# Altium project bms_afe_tester-1_0.PrjPcb (part 1 of 2)
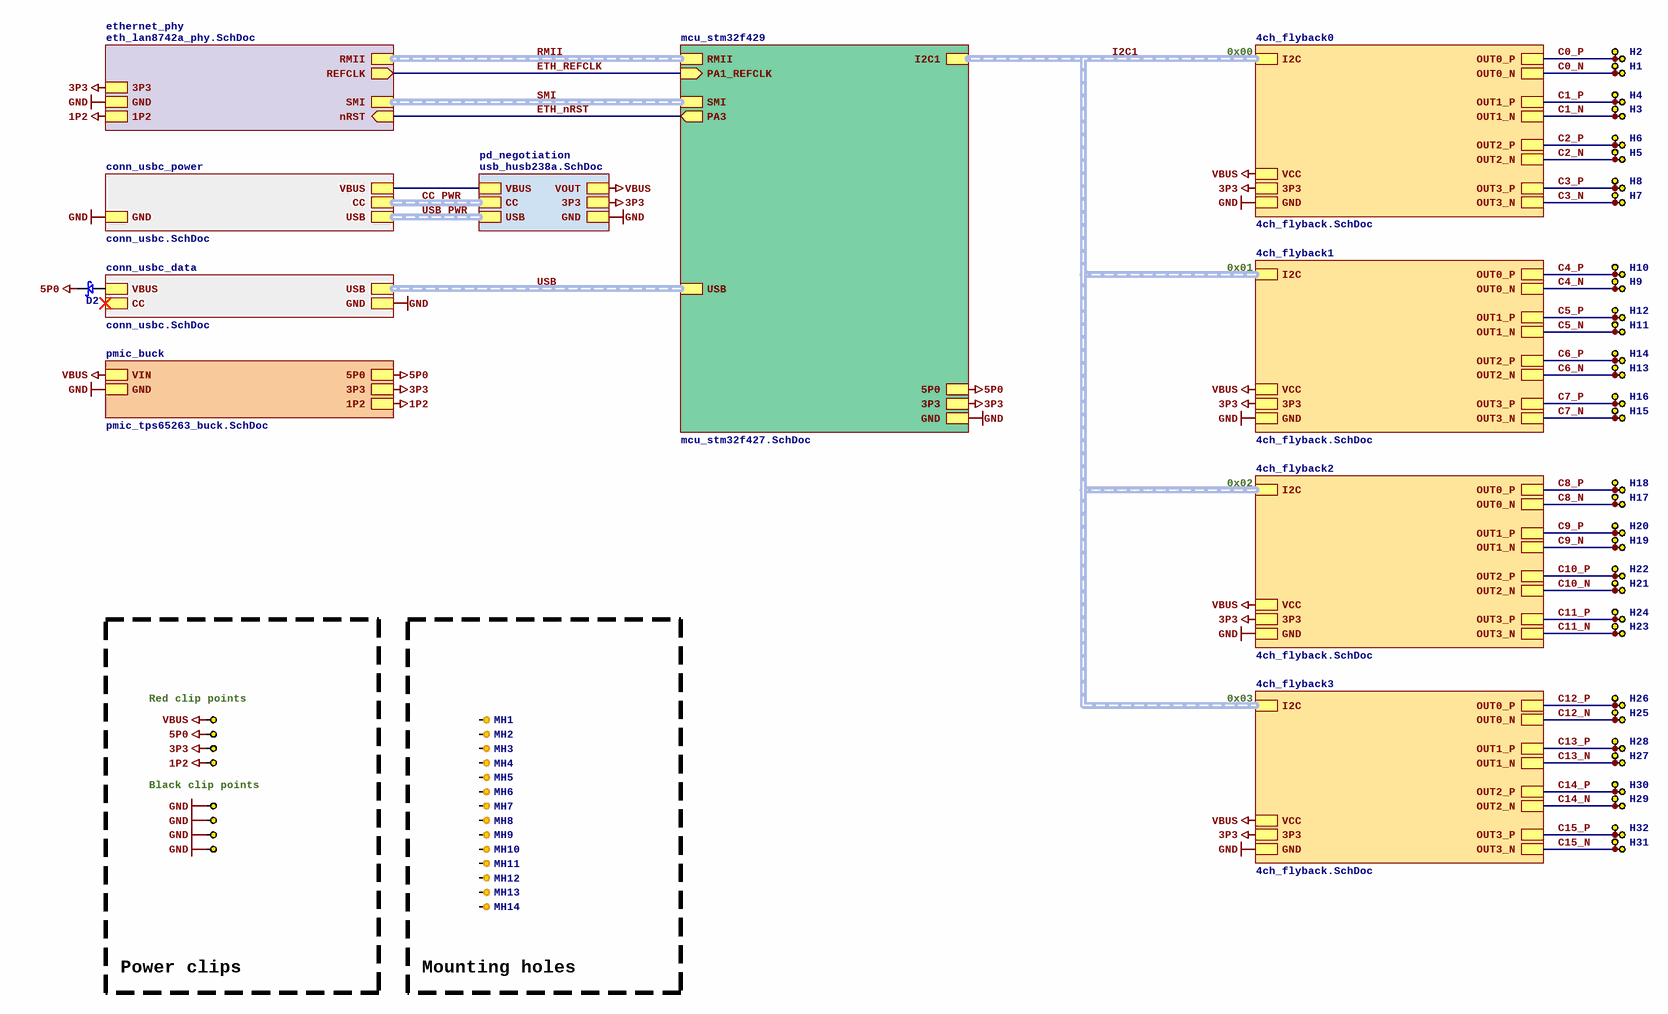
[diagram p0: top.SchDoc]
9 sheets, 576 parts. Net scope: strictly hierarchical (ports join the sheet entries above them; power ports are local).
Board file: bms_afe_tester-1_0.PcbDoc
Sheets:
  top.SchDoc
    mcu_stm32f429 = mcu_stm32f427.SchDoc
    conn_usbc_power = conn_usbc.SchDoc
    pd_negotiation = usb_husb238a.SchDoc
    ethernet_phy = eth_lan8742a_phy.SchDoc
    4ch_flyback0 = 4ch_flyback.SchDoc
      flyback0 = flyback_circuit.SchDoc
      flyback1 = flyback_circuit.SchDoc
      flyback2 = flyback_circuit.SchDoc
      flyback3 = flyback_circuit.SchDoc
      dac0 = dac_dac4320_4ch.SchDoc
    4ch_flyback1 = 4ch_flyback.SchDoc
      flyback0 = flyback_circuit.SchDoc
      flyback1 = flyback_circuit.SchDoc
      flyback2 = flyback_circuit.SchDoc
      flyback3 = flyback_circuit.SchDoc
      dac0 = dac_dac4320_4ch.SchDoc
    4ch_flyback2 = 4ch_flyback.SchDoc
      flyback0 = flyback_circuit.SchDoc
      flyback1 = flyback_circuit.SchDoc
      flyback2 = flyback_circuit.SchDoc
      flyback3 = flyback_circuit.SchDoc
      dac0 = dac_dac4320_4ch.SchDoc
    4ch_flyback3 = 4ch_flyback.SchDoc
      flyback0 = flyback_circuit.SchDoc
      flyback1 = flyback_circuit.SchDoc
      flyback2 = flyback_circuit.SchDoc
      flyback3 = flyback_circuit.SchDoc
      dac0 = dac_dac4320_4ch.SchDoc
    pmic_buck = pmic_tps65263_buck.SchDoc
    conn_usbc_data = conn_usbc.SchDoc

## Sheet top.SchDoc
size B; SheetNumber: 1

### Parts
D2  B340A-13-F  [SMA]  (value not drawn)
H1  SMTSO-M2-10ET  [SMTSO-M2-10ET]  (value not drawn)
H2  SMTSO-M2-10ET  [SMTSO-M2-10ET]  (value not drawn)
H3  SMTSO-M2-10ET  [SMTSO-M2-10ET]  (value not drawn)
H4  SMTSO-M2-10ET  [SMTSO-M2-10ET]  (value not drawn)
H5  SMTSO-M2-10ET  [SMTSO-M2-10ET]  (value not drawn)
H6  SMTSO-M2-10ET  [SMTSO-M2-10ET]  (value not drawn)
H7  SMTSO-M2-10ET  [SMTSO-M2-10ET]  (value not drawn)
H8  SMTSO-M2-10ET  [SMTSO-M2-10ET]  (value not drawn)
H9  SMTSO-M2-10ET  [SMTSO-M2-10ET]  (value not drawn)
H10  SMTSO-M2-10ET  [SMTSO-M2-10ET]  (value not drawn)
H11  SMTSO-M2-10ET  [SMTSO-M2-10ET]  (value not drawn)
H12  SMTSO-M2-10ET  [SMTSO-M2-10ET]  (value not drawn)
H13  SMTSO-M2-10ET  [SMTSO-M2-10ET]  (value not drawn)
H14  SMTSO-M2-10ET  [SMTSO-M2-10ET]  (value not drawn)
H15  SMTSO-M2-10ET  [SMTSO-M2-10ET]  (value not drawn)
H16  SMTSO-M2-10ET  [SMTSO-M2-10ET]  (value not drawn)
H17  SMTSO-M2-10ET  [SMTSO-M2-10ET]  (value not drawn)
H18  SMTSO-M2-10ET  [SMTSO-M2-10ET]  (value not drawn)
H19  SMTSO-M2-10ET  [SMTSO-M2-10ET]  (value not drawn)
H20  SMTSO-M2-10ET  [SMTSO-M2-10ET]  (value not drawn)
H21  SMTSO-M2-10ET  [SMTSO-M2-10ET]  (value not drawn)
H22  SMTSO-M2-10ET  [SMTSO-M2-10ET]  (value not drawn)
H23  SMTSO-M2-10ET  [SMTSO-M2-10ET]  (value not drawn)
H24  SMTSO-M2-10ET  [SMTSO-M2-10ET]  (value not drawn)
H25  SMTSO-M2-10ET  [SMTSO-M2-10ET]  (value not drawn)
H26  SMTSO-M2-10ET  [SMTSO-M2-10ET]  (value not drawn)
H27  SMTSO-M2-10ET  [SMTSO-M2-10ET]  (value not drawn)
H28  SMTSO-M2-10ET  [SMTSO-M2-10ET]  (value not drawn)
H29  SMTSO-M2-10ET  [SMTSO-M2-10ET]  (value not drawn)
H30  SMTSO-M2-10ET  [SMTSO-M2-10ET]  (value not drawn)
H31  SMTSO-M2-10ET  [SMTSO-M2-10ET]  (value not drawn)
H32  SMTSO-M2-10ET  [SMTSO-M2-10ET]  (value not drawn)
MH1  HOLE  [HOLE_M3]  (value not drawn)  (no BOM)
MH2  HOLE  [HOLE_M3]  (value not drawn)  (no BOM)
MH3  HOLE  [HOLE_M3]  (value not drawn)  (no BOM)
MH4  HOLE  [HOLE_M3]  (value not drawn)  (no BOM)
MH5  HOLE  [HOLE_M3]  (value not drawn)  (no BOM)
MH6  HOLE  [HOLE_M3]  (value not drawn)  (no BOM)
MH7  HOLE  [HOLE_M3]  (value not drawn)  (no BOM)
MH8  HOLE  [HOLE_M3]  (value not drawn)  (no BOM)
MH9  HOLE  [HOLE_M3]  (value not drawn)  (no BOM)
MH10  HOLE  [HOLE_M3]  (value not drawn)  (no BOM)
MH11  HOLE  [HOLE_M3]  (value not drawn)  (no BOM)
MH12  HOLE  [HOLE_M3]  (value not drawn)  (no BOM)
MH13  HOLE  [HOLE_M3]  (value not drawn)  (no BOM)
MH14  HOLE  [HOLE_M3]  (value not drawn)  (no BOM)
TP3  RH-5000  [TP_RH-5000]  (value not drawn)
TP4  RH-5000  [TP_RH-5000]  (value not drawn)
TP5  RH-5001  [TP_RH-5001]  (value not drawn)
TP6  RH-5000  [TP_RH-5000]  (value not drawn)
TP7  RH-5001  [TP_RH-5001]  (value not drawn)
TP8  RH-5000  [TP_RH-5000]  (value not drawn)
TP9  RH-5001  [TP_RH-5001]  (value not drawn)
TP10  RH-5000  [TP_RH-5000]  (value not drawn)
TP11  RH-5001  [TP_RH-5001]  (value not drawn)
TP12  RH-5000  [TP_RH-5000]  (value not drawn)
TP13  RH-5001  [TP_RH-5001]  (value not drawn)
TP14  RH-5000  [TP_RH-5000]  (value not drawn)
TP15  RH-5001  [TP_RH-5001]  (value not drawn)
TP16  RH-5000  [TP_RH-5000]  (value not drawn)
TP17  RH-5001  [TP_RH-5001]  (value not drawn)
TP18  RH-5000  [TP_RH-5000]  (value not drawn)
TP19  RH-5001  [TP_RH-5001]  (value not drawn)
TP20  RH-5000  [TP_RH-5000]  (value not drawn)
TP21  RH-5001  [TP_RH-5001]  (value not drawn)
TP22  RH-5000  [TP_RH-5000]  (value not drawn)
TP23  RH-5001  [TP_RH-5001]  (value not drawn)
TP24  RH-5000  [TP_RH-5000]  (value not drawn)
TP25  RH-5001  [TP_RH-5001]  (value not drawn)
TP26  RH-5000  [TP_RH-5000]  (value not drawn)
TP27  RH-5001  [TP_RH-5001]  (value not drawn)
TP28  RH-5000  [TP_RH-5000]  (value not drawn)
TP29  RH-5001  [TP_RH-5001]  (value not drawn)
TP30  RH-5000  [TP_RH-5000]  (value not drawn)
TP31  RH-5001  [TP_RH-5001]  (value not drawn)
TP32  RH-5000  [TP_RH-5000]  (value not drawn)
TP33  RH-5000  [TP_RH-5000]  (value not drawn)
TP34  RH-5001  [TP_RH-5001]  (value not drawn)
TP35  RH-5000  [TP_RH-5000]  (value not drawn)
TP36  RH-5000  [TP_RH-5000]  (value not drawn)
TP37  RH-5000  [TP_RH-5000]  (value not drawn)
TP38  RH-5001  [TP_RH-5001]  (value not drawn)
TP39  RH-5001  [TP_RH-5001]  (value not drawn)
TP41  RH-5001  [TP_RH-5001]  (value not drawn)
TP43  RH-5001  [TP_RH-5001]  (value not drawn)
TP45  RH-5001  [TP_RH-5001]  (value not drawn)

### Blocks framed on the sheet
Power clips: TP3 TP33 TP35 TP37 TP39 TP41 TP43 TP45
Mounting holes: MH1-MH14

### Sub-sheets
4ch_flyback0 = 4ch_flyback.SchDoc: GND, 3P3, VCC, I2C (harness I2C), OUT0_P, OUT1_P, OUT2_P, OUT3_P, OUT0_N, OUT1_N, OUT2_N, OUT3_N
4ch_flyback1 = 4ch_flyback.SchDoc: GND, 3P3, VCC, I2C (harness I2C), OUT0_P, OUT1_P, OUT2_P, OUT3_P, OUT0_N, OUT1_N, OUT2_N, OUT3_N
4ch_flyback2 = 4ch_flyback.SchDoc: GND, 3P3, VCC, I2C (harness I2C), OUT0_P, OUT1_P, OUT2_P, OUT3_P, OUT0_N, OUT1_N, OUT2_N, OUT3_N
4ch_flyback3 = 4ch_flyback.SchDoc: GND, 3P3, VCC, I2C (harness I2C), OUT0_P, OUT1_P, OUT2_P, OUT3_P, OUT0_N, OUT1_N, OUT2_N, OUT3_N
conn_usbc_data = conn_usbc.SchDoc: USB (harness DIFF), GND, VBUS, CC (harness CC)
conn_usbc_power = conn_usbc.SchDoc: USB (harness DIFF), GND, VBUS, CC (harness CC)
ethernet_phy = eth_lan8742a_phy.SchDoc: 3P3, GND, REFCLK (out), RMII (harness RMII), nRST (in), SMI (harness SMI), 1P2
mcu_stm32f429 = mcu_stm32f427.SchDoc: GND, 3P3, PA1_REFCLK (in), RMII (harness RMII), SMI (harness SMI), 5P0, USB (harness DIFF), I2C1 (harness I2C), PA3 (out)
pd_negotiation = usb_husb238a.SchDoc: CC (harness CC), GND, 3P3, VBUS, VOUT, USB (harness DIFF)
pmic_buck = pmic_tps65263_buck.SchDoc: 5P0, 3P3, GND, VIN, 1P2

### Nets
1P2: TP37.1 ; sheet ethernet_phy/1P2, sheet pmic_buck/1P2
3P3: TP35.1 ; sheet mcu_stm32f429/3P3, sheet pd_negotiation/3P3, sheet ethernet_phy/3P3, sheet 4ch_flyback0/3P3, sheet 4ch_flyback1/3P3, sheet 4ch_flyback2/3P3, sheet 4ch_flyback3/3P3, sheet pmic_buck/3P3
5P0: D2.2 TP33.1 ; sheet mcu_stm32f429/5P0, sheet pmic_buck/5P0
GND: TP39.1 TP41.1 TP43.1 TP45.1 ; sheet mcu_stm32f429/GND, sheet conn_usbc_power/GND, sheet pd_negotiation/GND, sheet ethernet_phy/GND, sheet 4ch_flyback0/GND, sheet 4ch_flyback1/GND, sheet 4ch_flyback2/GND, sheet 4ch_flyback3/GND, sheet pmic_buck/GND, sheet conn_usbc_data/GND
VBUS: TP3.1 ; sheet pd_negotiation/VOUT, sheet 4ch_flyback0/VCC, sheet 4ch_flyback1/VCC, sheet 4ch_flyback2/VCC, sheet 4ch_flyback3/VCC, sheet pmic_buck/VIN
C0_N: H1.1 TP5.1 ; sheet 4ch_flyback0/OUT0_N
C0_P: H2.1 TP4.1 ; sheet 4ch_flyback0/OUT0_P
C1_N: H3.1 TP7.1 ; sheet 4ch_flyback0/OUT1_N
C1_P: H4.1 TP6.1 ; sheet 4ch_flyback0/OUT1_P
C2_N: H5.1 TP9.1 ; sheet 4ch_flyback0/OUT2_N
C2_P: H6.1 TP8.1 ; sheet 4ch_flyback0/OUT2_P
C3_N: H7.1 TP11.1 ; sheet 4ch_flyback0/OUT3_N
C3_P: H8.1 TP10.1 ; sheet 4ch_flyback0/OUT3_P
C4_N: H9.1 TP13.1 ; sheet 4ch_flyback1/OUT0_N
C4_P: H10.1 TP12.1 ; sheet 4ch_flyback1/OUT0_P
C5_N: H11.1 TP15.1 ; sheet 4ch_flyback1/OUT1_N
C5_P: H12.1 TP14.1 ; sheet 4ch_flyback1/OUT1_P
C6_N: H13.1 TP17.1 ; sheet 4ch_flyback1/OUT2_N
C6_P: H14.1 TP16.1 ; sheet 4ch_flyback1/OUT2_P
C7_N: H15.1 TP19.1 ; sheet 4ch_flyback1/OUT3_N
C7_P: H16.1 TP18.1 ; sheet 4ch_flyback1/OUT3_P
C8_N: H17.1 TP21.1 ; sheet 4ch_flyback2/OUT0_N
C8_P: H18.1 TP20.1 ; sheet 4ch_flyback2/OUT0_P
C9_N: H19.1 TP23.1 ; sheet 4ch_flyback2/OUT1_N
C9_P: H20.1 TP22.1 ; sheet 4ch_flyback2/OUT1_P
C10_N: H21.1 TP25.1 ; sheet 4ch_flyback2/OUT2_N
C10_P: H22.1 TP24.1 ; sheet 4ch_flyback2/OUT2_P
C11_N: H23.1 TP27.1 ; sheet 4ch_flyback2/OUT3_N
C11_P: H24.1 TP26.1 ; sheet 4ch_flyback2/OUT3_P
C12_N: H25.1 TP29.1 ; sheet 4ch_flyback3/OUT0_N
C12_P: H26.1 TP28.1 ; sheet 4ch_flyback3/OUT0_P
C13_N: H27.1 TP31.1 ; sheet 4ch_flyback3/OUT1_N
C13_P: H28.1 TP30.1 ; sheet 4ch_flyback3/OUT1_P
C14_N: H29.1 TP34.1 ; sheet 4ch_flyback3/OUT2_N
C14_P: H30.1 TP32.1 ; sheet 4ch_flyback3/OUT2_P
C15_N: H31.1 TP38.1 ; sheet 4ch_flyback3/OUT3_N
C15_P: H32.1 TP36.1 ; sheet 4ch_flyback3/OUT3_P
ETH_nRST: sheet mcu_stm32f429/PA3, sheet ethernet_phy/nRST
ETH_REFCLK: sheet mcu_stm32f429/PA1_REFCLK, sheet ethernet_phy/REFCLK
NetC44_1: sheet conn_usbc_power/VBUS, sheet pd_negotiation/VBUS
NetC80B_1: D2.1 ; sheet conn_usbc_data/VBUS

Not connected (* = marked no-connect by the designer): MH1 1; MH2 1; MH3 1; MH4 1; MH5 1; MH6 1; MH7 1; MH8 1; MH9 1; MH10 1; MH11 1; MH12 1; MH13 1; MH14 1

### Buses and harness runs
harness CC_PWR = sheet conn_usbc_power/CC = sheet pd_negotiation/CC
harness I2C1 = sheet 4ch_flyback0/I2C = sheet 4ch_flyback1/I2C = sheet 4ch_flyback2/I2C = sheet 4ch_flyback3/I2C = sheet mcu_stm32f429/I2C1
harness RMII = sheet ethernet_phy/RMII = sheet mcu_stm32f429/RMII
harness SMI = sheet ethernet_phy/SMI = sheet mcu_stm32f429/SMI
harness USB = sheet conn_usbc_data/USB = sheet mcu_stm32f429/USB
harness USB_PWR = sheet conn_usbc_power/USB = sheet pd_negotiation/USB

### Notes on the sheet
- 0x00
- 0x01
- 0x02
- (near TP3) Red clip points
- 0x03
- Black clip points

### Library data of the parts
D2 = SCHOTTKY_B340A-13-F: Rectifier Diode, Schottky, 1 Phase, 1 Element, 3A, 40V V(RRM), Silicon; Manufacturer: Diodes; Supplier 1: Digikey; ComponentLink1URL: https://www.diodes.com/assets/Datasheets/ds30891.pdf; Supplier Part Number 1: B340A-FDICT-ND; Manufacturer Part Number: B340A-13-F; ComponentLink1Description: Datasheet; Supplier 2: LCSC; Supplier Part Number 2: C85098
H1-H32 = STANDOFF_SMTSO-M2-10ET: Standoff M2 x 0.4, electro-Plated Tin, ASTM B545, Class A with Clear Preservative Coating, Annealed, Internal, ASME B1.13M, 6H; Manufacturer 1: PennEngineering; Manufacturer Part Number: SMTSO-M2-10ET; ComponentLink1Description: Catalog; ComponentLink1URL: https://www.pemnet.com/wp-content/uploads/sites/2/2022/06/kdata.pdf; Supplier 1: Mouser; Supplier Part Number 1: 153-SMTSO-M2-10ET; Supplier 2: LCSC; Supplier Part Number 2: C2928171
TP3 TP4 TP6 TP8 TP10 TP12 TP14 TP16 TP18 TP20 TP22 TP24 TP26 TP28 TP30 TP32 TP33 TP35-TP37 = RH-5000: Manufacturer: ronghe; ComponentLink1Description: Datasheet; ComponentLink1URL: https://datasheet.lcsc.com/lcsc/2307040929_ronghe-RH-5000_C5277086.pdf; Manufacturer Part Number: RH-5000; Supplier 2: LCSC; Supplier Part Number 2: C5277086
TP5 TP7 TP9 TP11 TP13 TP15 TP17 TP19 TP21 TP23 TP25 TP27 TP29 TP31 TP34 TP38 TP39 TP41 TP43 TP45 = RH-5001: Manufacturer: ronghe; ComponentLink1Description: Datasheet; ComponentLink1URL: https://datasheet.lcsc.com/lcsc/2307040929_ronghe-RH-5000_C5277086.pdf; Manufacturer Part Number: RH-5001; Supplier 2: LCSC; Supplier Part Number 2: C5199801

## Sheet mcu_stm32f427.SchDoc
size C; SheetNumber: 2
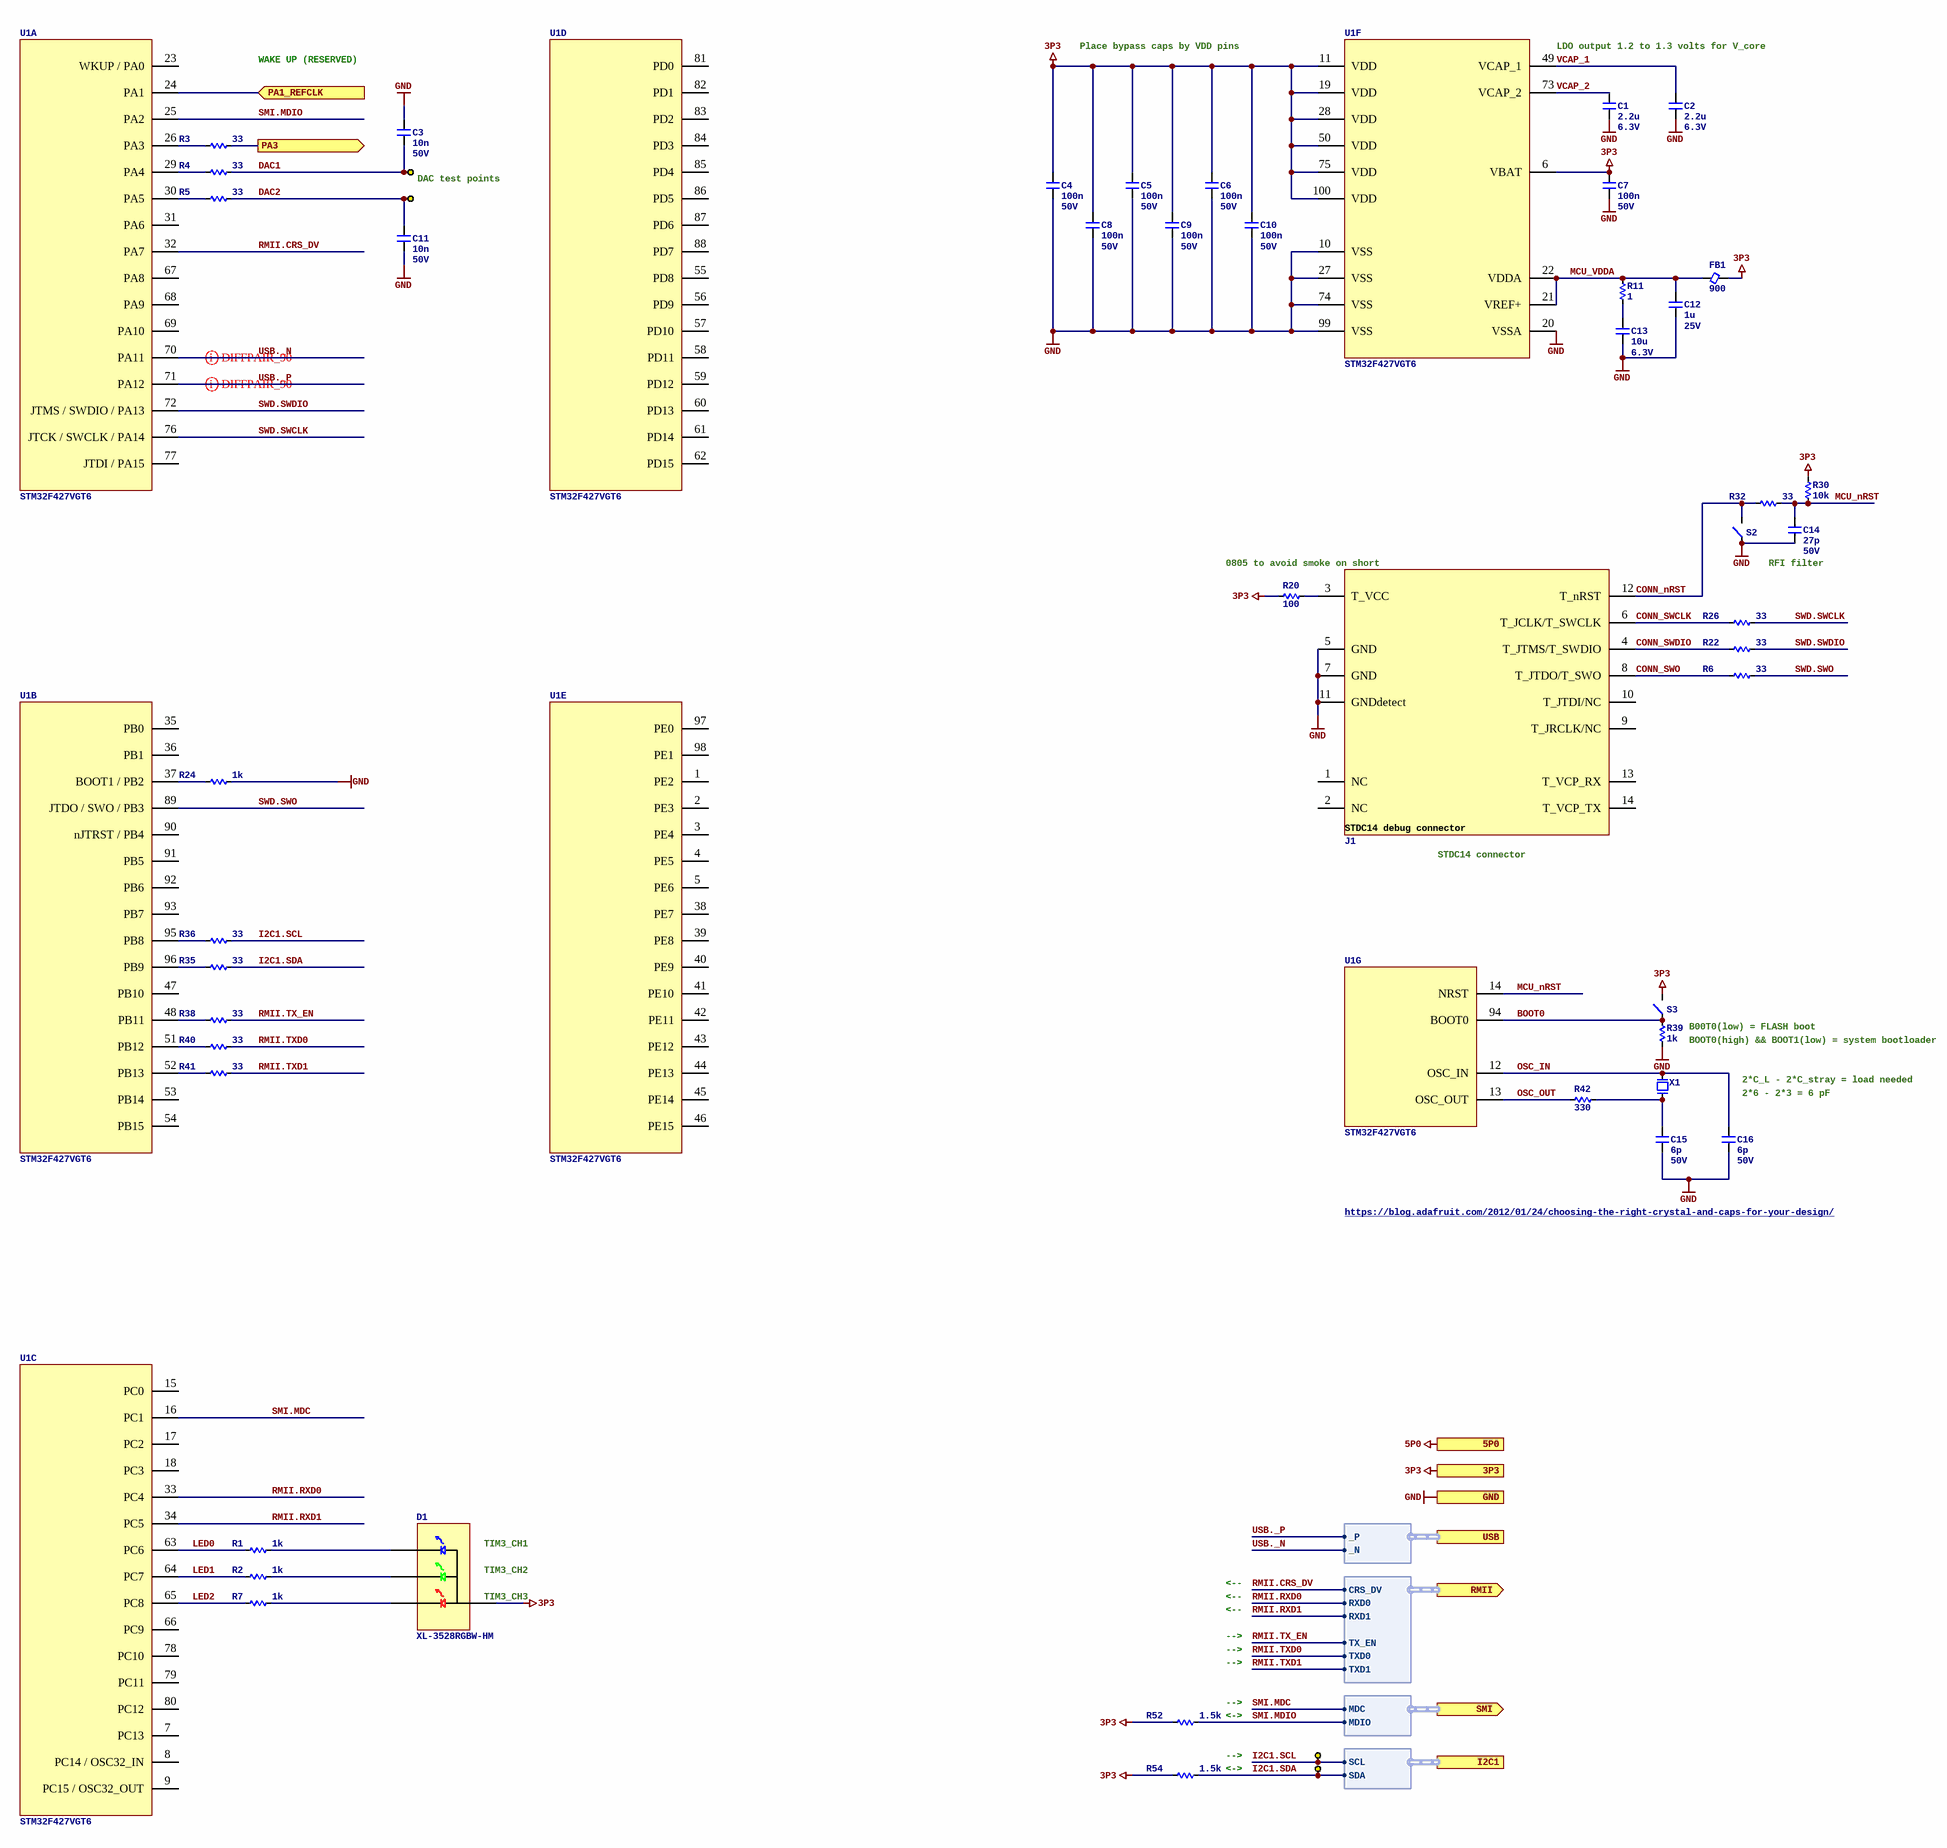
[diagram p1: mcu_stm32f427.SchDoc]

### Parts
C1  Capacitance: 2.2u  Voltage Rating: 6.3V  [C0603]  (hidden comment: GCM188R70J225KE22D)
C2  Capacitance: 2.2u  Voltage Rating: 6.3V  [C0603]  (hidden comment: GCM188R70J225KE22D)
C3  Capacitance: 10n  Voltage Rating: 50V  [C0402]  (hidden comment: CL05B103KB5NNNC)
C4  Capacitance: 100n  Voltage Rating: 50V  [C0402]  (hidden comment: CL05B104KB54PNC)
C5  Capacitance: 100n  Voltage Rating: 50V  [C0402]  (hidden comment: CL05B104KB54PNC)
C6  Capacitance: 100n  Voltage Rating: 50V  [C0402]  (hidden comment: CL05B104KB54PNC)
C7  Capacitance: 100n  Voltage Rating: 50V  [C0402]  (hidden comment: CL05B104KB54PNC)
C8  Capacitance: 100n  Voltage Rating: 50V  [C0402]  (hidden comment: CL05B104KB54PNC)
C9  Capacitance: 100n  Voltage Rating: 50V  [C0402]  (hidden comment: CL05B104KB54PNC)
C10  Capacitance: 100n  Voltage Rating: 50V  [C0402]  (hidden comment: CL05B104KB54PNC)
C11  Capacitance: 10n  Voltage Rating: 50V  [C0402]  (hidden comment: CL05B103KB5NNNC)
C12  Capacitance: 1u  Voltage Rating: 25V  [C0603]  (hidden comment: CL10B105KA8NNNC)
C13  Capacitance: 10u  Voltage Rating: 6.3V  [C0805]  (hidden comment: CC0805KKX7R5BB106)
C14  Capacitance: 27p  Voltage Rating: 50V  [C0402]  (hidden comment: CC0402JRNPO9BN270)
C15  Capacitance: 6p  Voltage Rating: 50V  [C0402]  (hidden comment: CC0402CRNPO9BN6R0)
C16  Capacitance: 6p  Voltage Rating: 50V  [C0402]  (hidden comment: CC0402CRNPO9BN6R0)
D1  XL-3528RGBW-HM  [LED_RGB_SMD3528-4P]
FB1  Current Rating (mA): 900  [FB0402]  (hidden comment: BLM15PX601SN1D)
J1  FTSH-107-01-L-DV-K-A  [SAMTEC_FTSH-107-01-L-DV-K-A]  (value not drawn)
R1  value 1k  [R0402]  (hidden comment: 0402WGF1001TCE)
R2  value 1k  [R0402]  (hidden comment: 0402WGF1001TCE)
R3  value 33  [R0402]  (hidden comment: CRCW040233R0FKED)
R4  value 33  [R0402]  (hidden comment: CRCW040233R0FKED)
R5  value 33  [R0402]  (hidden comment: CRCW040233R0FKED)
R6  value 33  [R0402]  (hidden comment: CRCW040233R0FKED)
R7  value 1k  [R0402]  (hidden comment: 0402WGF1001TCE)
R11  value 1  [R0402]  (hidden comment: CRCW04021R00FKEDC)
R20  value 100  [R0805]  (hidden comment: AR05FTC1000)
R22  value 33  [R0402]  (hidden comment: CRCW040233R0FKED)
R24  value 1k  [R0402]  (hidden comment: 0402WGF1001TCE)
R26  value 33  [R0402]  (hidden comment: CRCW040233R0FKED)
R30  value 10k  [R0402]  (hidden comment: 0402WGF1002TCE)
R32  value 33  [R0402]  (hidden comment: CRCW040233R0FKED)
R35  value 33  [R0402]  (hidden comment: CRCW040233R0FKED)
R36  value 33  [R0402]  (hidden comment: CRCW040233R0FKED)
R38  value 33  [R0402]  (hidden comment: CRCW040233R0FKED)
R39  value 1k  [R0402]  (hidden comment: 0402WGF1001TCE)
R40  value 33  [R0402]  (hidden comment: CRCW040233R0FKED)
R41  value 33  [R0402]  (hidden comment: CRCW040233R0FKED)
R42  value 330  [R0402]  (hidden comment: 0402WGF3300TCE)
R52  value 1.5k  [R0402]  (hidden comment: 0402WGF1501TCE)
R54  value 1.5k  [R0402]  (hidden comment: 0402WGF1501TCE)
S2  TS-1092S-B3D2-G  [SWITCH_TS-1092S-B3D2-G]  (value not drawn)
S3  TS-1092S-B3D2-G  [SWITCH_TS-1092S-B3D2-G]  (value not drawn)
TP1  (no value)  [TP_RH-5002]
TP2  (no value)  [TP_RH-5002]
TP62  (no value)  [TP_GRABBY]  (no BOM)
TP63  (no value)  [TP_GRABBY]  (no BOM)
U1  STM32F427VGT6  [100TQFP14]  (parts A,B,C,D,E,F,G of 7)
X1  XTAL_XRCGB25M000F3A00R0  [4_SMD_2.0X1.6MM]  (value not drawn)

### Ports
3P3, 5P0, GND, I2C1 (harness I2C), PA1_REFCLK (in), PA3 (out), RMII (out, harness RMII), SMI (out, harness SMI), USB (harness DIFF)

### Harnesses
RMII: CRS_DV, RXD0, RXD1, TX_EN, TXD0, TXD1
SMI: MDC, MDIO
DIFF: _P, _N
I2C: SCL, SDA

### Nets
3P3: C4.1 C5.1 C6.1 C7.1 C8.1 C9.1 C10.1 D1.2 FB1.2 R20.2 R30.1 R52.2 R54.2 S3.2 U1.6(VBAT) U1.11(VDD) U1.19(VDD) U1.28(VDD) U1.50(VDD) U1.75(VDD) U1.100(VDD) ; port 3P3
GND: C1.2 C2.2 C3.2 C4.2 C5.2 C6.2 C7.2 C8.2 C9.2 C10.2 C11.2 C12.2 C13.2 C14.2 C15.2 C16.2 J1.5(GND) J1.7(GND) J1.11(GNDdetect) R24.1 R39.2 S2.1 U1.10(VSS) U1.20(VSSA) U1.27(VSS) U1.74(VSS) U1.99(VSS) ; port GND
BOOT0: R39.1 S3.1 U1.94(BOOT0)  [project net BOOT0_2]
CONN_nRST: J1.12(T_nRST) R32.2 S2.2  [project net CONN_nRST_2]
CONN_SWCLK: J1.6(T_JCLK/T_SWCLK) R26.2  [project net CONN_SWCLK_2]
CONN_SWDIO: J1.4(T_JTMS/T_SWDIO) R22.2  [project net CONN_SWDIO_2]
CONN_SWO: J1.8(T_JTDO/T_SWO) R6.2  [project net CONN_SWO_2]
DAC1: C3.1 R4.1 TP1.1  [project net DAC1_2]
DAC2: C11.1 R5.1 TP2.1  [project net DAC2_2]
ETH_nRST: R3.1 ; port PA3
ETH_REFCLK: U1.24(PA1) ; port PA1_REFCLK
I2C1.SCL: R36.1 TP62.1 ; port I2C1.SCL
I2C1.SDA: R35.1 R54.1 TP63.1 ; port I2C1.SDA
LED0: R1.2 U1.63(PC6)  [project net LED0_2]
LED1: R2.2 U1.64(PC7)  [project net LED1_2]
LED2: R7.2 U1.65(PC8)  [project net LED2_2]
MCU_nRST: C14.1 R30.2 R32.1 U1.14(NRST)  [project net MCU_nRST_2]
MCU_VDDA: C12.1 FB1.1 R11.2 U1.21(VREF+) U1.22(VDDA)  [project net MCU_VDDA_2]
OSC_IN: C16.1 U1.12(OSC_IN) X1.3  [project net OSC_IN_2]
OSC_OUT: R42.1 U1.13(OSC_OUT)  [project net OSC_OUT_2]
RMII.CRS_DV: U1.32(PA7) ; port RMII.CRS_DV
RMII.RXD0: U1.33(PC4) ; port RMII.RXD0
RMII.RXD1: U1.34(PC5) ; port RMII.RXD1
RMII.TX_EN: R38.1 ; port RMII.TX_EN
RMII.TXD0: R40.1 ; port RMII.TXD0
RMII.TXD1: R41.1 ; port RMII.TXD1
SMI.MDC: U1.16(PC1) ; port SMI.MDC
SMI.MDIO: R52.1 U1.25(PA2) ; port SMI.MDIO
SWD.SWCLK: R26.1 U1.76(JTCK_/_SWCLK_/_PA14)  [project net SWD.SWCLK_2]
SWD.SWDIO: R22.1 U1.72(JTMS_/_SWDIO_/_PA13)  [project net SWD.SWDIO_2]
SWD.SWO: R6.1 U1.89(JTDO_/_SWO_/_PB3)  [project net SWD.SWO_2]
USB._N: U1.70(PA11) ; port USB._N
USB._P: U1.71(PA12) ; port USB._P
VCAP_1: C2.1 U1.49(VCAP_1)  [project net VCAP_1_2]
VCAP_2: C1.1 U1.73(VCAP_2)  [project net VCAP_2_2]
NetC13_1: C13.1 R11.1
NetC15_1: C15.1 R42.2 X1.1
NetD1_1: D1.1 R7.1
NetD1_3: D1.3 R2.1
NetD1_4: D1.4 R1.1
NetJ1_3: J1.3(T_VCC) R20.1
NetR3_2: R3.2 U1.26(PA3)
NetR4_2: R4.2 U1.29(PA4)
NetR5_2: R5.2 U1.30(PA5)
NetR24_2: R24.2 U1.37(BOOT1_/_PB2)
NetR35_2: R35.2 U1.96(PB9)
NetR36_2: R36.2 U1.95(PB8)
NetR38_2: R38.2 U1.48(PB11)
NetR40_2: R40.2 U1.51(PB12)
NetR41_2: R41.2 U1.52(PB13)

Not connected (* = marked no-connect by the designer): J1 1(NC) 2(NC) 9(T_JRCLK/NC) 10(T_JTDI/NC) 13(T_VCP_RX) 14(T_VCP_TX); U1 1(PE2) 2(PE3) 3(PE4) 4(PE5) 5(PE6) 7(PC13) 8(PC14_/_OSC32_IN) 9(PC15_/_OSC32_OUT) 15(PC0) 17(PC2) 18(PC3) 23(WKUP_/_PA0) 31(PA6) 35(PB0) 36(PB1) 38(PE7) 39(PE8) 40(PE9) 41(PE10) 42(PE11) 43(PE12) 44(PE13) 45(PE14) 46(PE15) 47(PB10) 53(PB14) 54(PB15) 55(PD8) 56(PD9) 57(PD10) 58(PD11) 59(PD12) 60(PD13) 61(PD14) 62(PD15) 66(PC9) 67(PA8) 68(PA9) 69(PA10) 77(JTDI_/_PA15) 78(PC10) 79(PC11) 80(PC12) 81(PD0) 82(PD1) 83(PD2) 84(PD3) 85(PD4) 86(PD5) 87(PD6) 88(PD7) 90(nJTRST_/_PB4) 91(PB5) 92(PB6) 93(PB7) 97(PE0) 98(PE1)

### Layout directives
differential pair; differential pair class DE_90: USB._N, USB._P

### Notes on the sheet
- WAKE UP (RESERVED)
- Place bypass caps by VDD pins
- (near U1) LDO output 1.2 to 1.3 volts for V_core
- (near TP1) DAC test points
- 0805 to avoid smoke on short
- RFI filter
- (near J1) STDC14 connector
- B00T0(low) = FLASH boot
- BOOT0(high) && BOOT1(low) = system bootloader
- 2*C_L - 2*C_stray = load needed
- (near C16) 2*6 - 2*3 = 6 pF
- https://blog.adafruit.com/2012/01/24/choosing-the-right-crystal-and-caps-for-your-design/
- (near D1) TIM3_CH1
- (near D1) TIM3_CH2
- <--
- (near D1) TIM3_CH3
- -->
- (near R52) <->
- (near R52) -->
- (near R54) <->
- (in symbol CONN_14POS_50MIL_ST_CORTEX_DEBUG_VCP) STDC14 debug connector

### Library data of the parts
C1 C2 = GCM188R70J225KE22D: Manufacturer: Murata Electronics; Dielectric: X7R; ComponentLink1URL: https://wmsc.lcsc.com/wmsc/upload/file/pdf/v2/lcsc/1810311130_Murata-Electronics-GCM188R70J225KE22D_C126582.pdf; ComponentLink1Description: Datasheet; Manufacturer Part Number: GCM188R70J225KE22D; Package: 0603; Supplier 2: LCSC; Supplier Part Number 2: C126582
C3 C11 = CL05B103KB5NNNC: Manufacturer: Samsung Electro-Mechanics; Dielectric: X7R; ComponentLink1URL: https://wmsc.lcsc.com/wmsc/upload/file/pdf/v2/lcsc/2304140030_Samsung-Electro-Mechanics-CL05B103KB5NNNC_C15195.pdf; ComponentLink1Description: Datasheet; Manufacturer Part Number: CL05B103KB5NNNC; Package: 0402; Supplier 2: LCSC; Supplier Part Number 2: C15195
C4-C10 = CL05B104KB54PNC: Manufacturer: Samsung Electro-Mechanics; Dielectric: X7R; ComponentLink1URL: https://wmsc.lcsc.com/wmsc/upload/file/pdf/v2/lcsc/2304140030_Samsung-Electro-Mechanics-CL05B104KB54PNC_C307331.pdf; ComponentLink1Description: Datasheet; Manufacturer Part Number: CL05B104KB54PNC; Package: 0402; Supplier 2: LCSC; Supplier Part Number 2: C307331
C12 = CL10B105KA8NNNC: Manufacturer: Samsung Electro-Mechanics; Dielectric: X7R; ComponentLink1URL: https://wmsc.lcsc.com/wmsc/upload/file/pdf/v2/lcsc/2304140030_Samsung-Electro-Mechanics-CL10B105KA8NNNC_C29936.pdf; ComponentLink1Description: Datasheet; Manufacturer Part Number: CL10B105KA8NNNC; Package: 0603; Supplier 2: LCSC; Supplier Part Number 2: C29936
C13 = CC0805KKX7R5BB106: Manufacturer: YAGEO; Dielectric: X7R; ComponentLink1URL: https://wmsc.lcsc.com/wmsc/upload/file/pdf/v2/lcsc/2409272300_YAGEO-CC0805KKX7R5BB106_C527225.pdf; ComponentLink1Description: Datasheet; Manufacturer Part Number: CC0805KKX7R5BB106; Package: 0805; Supplier 2: LCSC; Supplier Part Number 2: C527225
C14 = CC0402JRNPO9BN270: Manufacturer: YAGEO; Dielectric: NP0; ComponentLink1URL: https://wmsc.lcsc.com/wmsc/upload/file/pdf/v2/lcsc/2304140030_YAGEO-CC0402JRNPO9BN270_C107002.pdf; ComponentLink1Description: Datasheet; Manufacturer Part Number: CC0402JRNPO9BN270; Package: 0402; Supplier 2: LCSC; Supplier Part Number 2: C107002
C15 C16 = CC0402CRNPO9BN6R0: Manufacturer: YAGEO; Dielectric: NP0; ComponentLink1URL: https://wmsc.lcsc.com/wmsc/upload/file/pdf/v2/lcsc/2007101237_YAGEO-CC0402CRNPO9BN6R0_C700515.pdf; ComponentLink1Description: Datasheet; Manufacturer Part Number: CC0402CRNPO9BN6R0; Package: 0402; Supplier 2: LCSC; Supplier Part Number 2: C700515
D1 = LED_RGB_XL-3528RGBW-HM: LED Multi-Color Chip Red/Green/Blue 621nm/525nm/468nm 25mA/15mA/15mA 4-Pin PLCC T/R; Manufacturer: XINGLIGHT; Supplier 1: Digikey; Supplier Part Number 1: 5962-XL-3528RGBW-HMTR-ND; Manufacturer Part Number: XL-3528RGBW-HM; ComponentLink1Description: Datasheet; ComponentLink1URL: https://mm.digikey.com/Volume0/opasdata/d220001/medias/docus/8903/XL-3528RGBW-HM.pdf; Supplier 2: LCSC; Supplier Part Number 2: C2843813
FB1 = BLM15PX601SN1D: Manufacturer: Murata Electronics; Z @ 100 MHz: 600; DCR (mOhms): 230; ComponentLink1URL: https://wmsc.lcsc.com/wmsc/upload/file/pdf/v2/lcsc/2304140030_Murata-Electronics-BLM15PX601SN1D_C160977.pdf; ComponentLink1Description: Datasheet; Manufacturer Part Number: BLM15PX601SN1D; Supplier 2: LCSC; Supplier Part Number 2: C160977; Package: 0402
J1 = CONN_14POS_50MIL_ST_CORTEX_DEBUG_VCP: Connector Header Surface Mount 14 position 0.050" (1.27mm); Manufacturer: Samtec; Supplier 1: Digikey; Supplier Part Number 1: FTSH-107-01-L-DV-K-A-ND; Manufacturer Part Number: FTSH-107-01-L-DV-K-A; Supplier 2: LCSC; Supplier Part Number 2: C5563894; ComponentLink2URL: https://mm.digikey.com/Volume0/opasdata/d220001/medias/docus/6209/ftsh-1xx-xx-xxx-dv-xxx-xxx-x-xx-mkt.pdf; ComponentLink2Description: Datasheet
R1 R2 R7 R24 R39 = 0402WGF1001TCE: Manufacturer: UNI-ROYAL(Uniroyal Elec); Tolerance: 1%; Temperature Coefficient: Â±100ppm/â„ƒ; Power Rating (mW): 62.5; ComponentLink1Description: Datasheet; ComponentLink1URL: https://wmsc.lcsc.com/wmsc/upload/file/pdf/v2/lcsc/2206010216_UNI-ROYAL-Uniroyal-Elec-0402WGF1001TCE_C11702.pdf; Manufacturer Part Number: 0402WGF1001TCE; Package: 0402; Supplier 2: LCSC; Supplier Part Number 2: C11702
R3-R6 R22 R26 R32 R35 R36 R38 R40 R41 = CRCW040233R0FKED: Manufacturer: Vishay Intertech; Tolerance: 1%; Temperature Coefficient: Â±100ppm/â„ƒ; Power Rating (mW): 63; ComponentLink1Description: Datasheet; ComponentLink1URL: https://wmsc.lcsc.com/wmsc/upload/file/pdf/v2/lcsc/2304140030_Vishay-Intertech-CRCW040233R0FKED_C242490.pdf; Manufacturer Part Number: CRCW040233R0FKED; Package: 0402; Supplier 2: LCSC; Supplier Part Number 2: C242490
R11 = CRCW04021R00FKEDC: Manufacturer: Vishay Intertech; Tolerance: 1%; Temperature Coefficient: Â±100ppm/â„ƒ; Power Rating (mW): 62.5; ComponentLink1Description: Datasheet; ComponentLink1URL: https://datasheet.lcsc.com/lcsc/2304140030_Vishay-Intertech-CRCW04021R00FKEDC_C2077765.pdf; Manufacturer Part Number: CRCW04021R00FKEDC; Package: 0402; Supplier 2: LCSC; Supplier Part Number 2: C2077765
R20 = AR05FTC1000: Manufacturer: Viking Tech; Tolerance: 1%; Temperature Coefficient: Â±25ppm/â„ƒ; ComponentLink1Description: Datasheet; ComponentLink1URL: https://wmsc.lcsc.com/wmsc/upload/file/pdf/v2/lcsc/2409280202_Viking-Tech-AR05FTC1000_C234699.pdf; Manufacturer Part Number: AR05FTC1000; Package: 0805; Power Rating (mW): 100; Supplier 2: LCSC; Supplier Part Number 2: C234699
R30 = 0402WGF1002TCE: Manufacturer: UNI-ROYAL(Uniroyal Elec); Tolerance: 1%; Temperature Coefficient: Â±100ppm/â„ƒ; Power Rating (mW): 62.5; ComponentLink1Description: Datasheet; ComponentLink1URL: https://wmsc.lcsc.com/wmsc/upload/file/pdf/v2/lcsc/2206010100_UNI-ROYAL-Uniroyal-Elec-0402WGF1002TCE_C25744.pdf; Manufacturer Part Number: 0402WGF1002TCE; Package: 0402; Supplier 2: LCSC; Supplier Part Number 2: C25744
R42 = 0402WGF3300TCE: Manufacturer: UNI-ROYAL(Uniroyal Elec); Tolerance: 1%; Temperature Coefficient: Â±100ppm/â„ƒ; Power Rating (mW): 62.5; ComponentLink1Description: Datasheet; ComponentLink1URL: https://wmsc.lcsc.com/wmsc/upload/file/pdf/v2/lcsc/2205311900_UNI-ROYAL-Uniroyal-Elec-0402WGF3300TCE_C25104.pdf; Manufacturer Part Number: 0402WGF3300TCE; Package: 0402; Supplier 2: LCSC; Supplier Part Number 2: C25104
R52 R54 = 0402WGF1501TCE: Manufacturer: UNI-ROYAL(Uniroyal Elec); Tolerance: 1%; Temperature Coefficient: Â±100ppm/â„ƒ; Power Rating (mW): 62.5; ComponentLink1Description: Datasheet; ComponentLink1URL: https://wmsc.lcsc.com/wmsc/upload/file/pdf/v2/lcsc/2206010045_UNI-ROYAL-Uniroyal-Elec-0402WGF1501TCE_C25867.pdf; Manufacturer Part Number: 0402WGF1501TCE; Package: 0402; Supplier 2: LCSC; Supplier Part Number 2: C25867
S2 S3 = SWITCH_TS-1092S-B3D2-G: SWITCH TACTILE SPST-NO; Manufacturer: Yuandi; Supplier 1: LCSC; Supplier Part Number 1: C520860; Manufacturer Part Number: TS-1092S-B3D2-G; ComponentLink1Description: Datasheet; ComponentLink1URL: https://www.lcsc.com/datasheet/lcsc_datasheet_2005071437_Yuandi-TS-1092S-B3D2-G_C520860.pdf
TP1 TP2 = RH-5002: THT white clip turret; Manufacturer: ronghe; ComponentLink1Description: Datasheet; ComponentLink1URL: https://datasheet.lcsc.com/lcsc/2307040929_ronghe-RH-5000_C5277086.pdf; Supplier 1: LCSC; Supplier Part Number 1: C5199802; Manufacturer Part Number: RH-5002
TP62 TP63 = TEST_GRABBER: EMBEDDED TEST POINT FOR SALEAE TEST CLIPS
U1 = MCU_STM32F427VGT6: ARM Cortex®-M4 STM32F4 Microcontroller IC 32-Bit 180MHz 1MB (1M x 8) FLASH 100-LQFP (14x14); Manufacturer: ST Microelectronics; Manufacturer Part Number: STM32F427VGT6; Supplier 1: Digikey; Supplier Part Number 1: 497-17449-ND; Supplier 2: LCSC; Supplier Part Number 2: C117815; ComponentLink1Description: Datasheet; ComponentLink1URL: https://www.st.com/content/ccc/resource/technical/document/datasheet/03/b4/b2/36/4c/72/49/29/DM00071990.pdf/files/DM00071990.pdf/jcr:content/translations/en.DM00071990.pdf; ComponentLink2Description: Reference Manual; ComponentLink2URL: https://www.st.com/resource/en/reference_manual/rm0090-stm32f405415-stm32f407417-stm32f427437-and-stm32f429439-advanced-armbased-32bit-mcus-stmicroelectronics.pdf; ComponentLink3Description: AN1709: Bootloader; ComponentLink3URL: https://www.st.com/resource/en/application_note/an2606-stm32-microcontroller-system-memory-boot-mode-stmicroelectronics.pdf
X1 = XTAL_XRCGB25M000F3A00R0: CRYSTAL 25.000MHZ 6PF SMD; Manufacturer: Murata; Supplier 1: Digikey; Supplier Part Number 1: 490-12146-2-ND; Manufacturer Part Number: XRCGB25M000F3A00R0; Supplier 2: LCSC; Supplier Part Number 2: C467842; ComponentLink1Description: Datasheet; ComponentLink1URL: https://www.murata.com/products/productdata/8801076543518/SPEC-XRCGB25M000F3A00R0.pdf

## Sheet conn_usbc.SchDoc
size A
Used 2 times, as channels conn_usbc_power, conn_usbc_data. Parts and nets are listed once, with the designators drawn on the sheet.
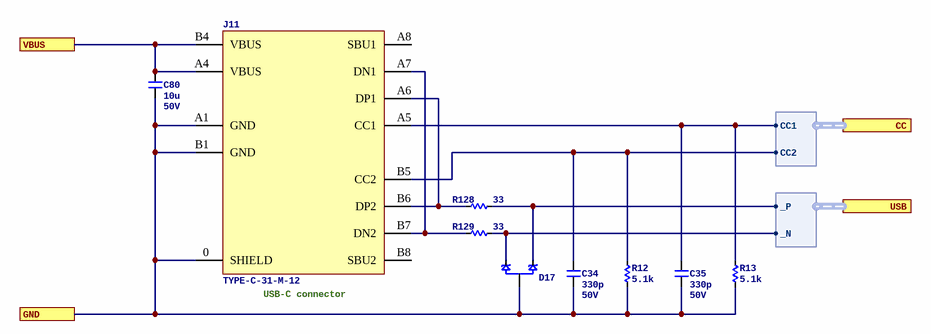
[diagram p2: conn_usbc.SchDoc]

### Parts
C34  Capacitance: 330p  Voltage Rating: 50V  [C0402]  (hidden comment: CL05C331JB5NNNC)
C35  Capacitance: 330p  Voltage Rating: 50V  [C0402]  (hidden comment: CL05C331JB5NNNC)
C80  Capacitance: 10u  Voltage Rating: 50V  [C1206]  (hidden comment: CL31B106KBHNNNE)
D17  PESD2USB3UX  [3SOT23]  (value not drawn)
J11  TYPE-C-31-M-12  [CONN_USBC_TYPE-C-31-M-12]
R12  value 5.1k  [R0402]  (hidden comment: 0402WGF5101TCE)
R13  value 5.1k  [R0402]  (hidden comment: 0402WGF5101TCE)
R128  value 33  [R0402]  (hidden comment: CRCW040233R0FKED)
R129  value 33  [R0402]  (hidden comment: CRCW040233R0FKED)

### Ports
CC (harness CC), GND, USB (harness DIFF), VBUS

### Harnesses
DIFF: _P, _N
CC: CC2, CC1

### Nets
GND: C34.2 C35.2 C80.2 D17.3 J11.0(SHIELD) J11.A1(GND) J11.B1(GND) R12.2 R13.2 ; port GND
VBUS: C80.1 J11.A4(VBUS) J11.B4(VBUS) ; port VBUS
NetC34_1: C34.1 J11.B5(CC2) R12.1 ; port CC.CC2
NetC35_1: C35.1 J11.A5(CC1) R13.1 ; port CC.CC1
NetD17_1: D17.1 R128.1 ; port USB._P
NetD17_2: D17.2 R129.1 ; port USB._N
NetJ11_A6: J11.A6(DP1) J11.B6(DP2) R128.2
NetJ11_A7: J11.A7(DN1) J11.B7(DN2) R129.2

Not connected (* = marked no-connect by the designer): J11 A8(SBU1) B8(SBU2)

### Channels
conn_usbc_power: designators end in A; ports GND=GND VBUS=NetC44_1
conn_usbc_data: designators end in B; ports GND=GND VBUS=NetC80B_1

### Notes on the sheet
- (near J11) USB-C connector

### Library data of the parts
C34 C35 = CL05C331JB5NNNC: Manufacturer: Samsung Electro-Mechanics; Dielectric: C0G; ComponentLink1URL: https://wmsc.lcsc.com/wmsc/upload/file/pdf/v2/lcsc/2304140030_Samsung-Electro-Mechanics-CL05C331JB5NNNC_C13533.pdf; ComponentLink1Description: Datasheet; Manufacturer Part Number: CL05C331JB5NNNC; Package: 0402; Supplier 2: LCSC; Supplier Part Number 2: C13533
C80 = CL31B106KBHNNNE: Manufacturer: Samsung Electro-Mechanics; Dielectric: X7R; ComponentLink1URL: https://wmsc.lcsc.com/wmsc/upload/file/pdf/v2/lcsc/1810221111_Samsung-Electro-Mechanics-CL31B106KBHNNNE_C89632.pdf; ComponentLink1Description: Datasheet; Manufacturer Part Number: CL31B106KBHNNNE; Package: 1206; Supplier 2: LCSC; Supplier Part Number 2: C89632
D17 = TVS_PESD2USB3UX-T: DIODE ESD USB SOT-23; Manufacturer: Nexperia USA Inc.; Supplier 1: Digikey; Supplier Part Number 1: 1727-PESD2USB3UX-CT-ND; Manufacturer Part Number: PESD2USB3UX; Supplier 2: LCSC; Supplier Part Number 2: C3708426; ComponentLink1Description: Datasheet; ComponentLink1URL: https://assets.nexperia.com/documents/data-sheet/PESD2USB3UX-T.pdf
J11 = CONN_USBC_TYPE-C-31-M-12: 5A 1 16P Female Type-C SMD USB Connectors ROHS; Manufacturer: HRO Electronics; ComponentLink1Description: Product page; ComponentLink1URL: https://en.krhro.com/Product-Details/726.html; ComponentLink2Description: Drawing; ComponentLink2URL: https://omo-oss-file.thefastfile.com/portal-saas/new2023011311465142457/cms/file/95f41c83-14fa-41cb-9f86-8d6a717317e5.pdf; Supplier 1: LCSC; Supplier Part Number 1: C165948; Manufacturer Part Number: TYPE-C-31-M-12
R12 R13 = 0402WGF5101TCE: Manufacturer: UNI-ROYAL(Uniroyal Elec); Tolerance: 1%; Temperature Coefficient: Â±100ppm/â„ƒ; Power Rating (mW): 62.5; ComponentLink1Description: Datasheet; ComponentLink1URL: https://wmsc.lcsc.com/wmsc/upload/file/pdf/v2/lcsc/2206010045_UNI-ROYAL-Uniroyal-Elec-0402WGF5101TCE_C25905.pdf; Manufacturer Part Number: 0402WGF5101TCE; Package: 0402; Supplier 2: LCSC; Supplier Part Number 2: C25905
R128 R129 = CRCW040233R0FKED: as R3 on sheet mcu_stm32f427; ComponentLink1Description: Datasheet; ComponentLink1URL: https://wmsc.lcsc.com/wmsc/upload/file/pdf/v2/lcsc/2304140030_Vishay-Intertech-CRCW040233R0FKED_C242490.pdf; Manufacturer Part Number: CRCW040233R0FKED; Package: 0402; Supplier 2: LCSC; Supplier Part Number 2: C242490

## Sheet usb_husb238a.SchDoc
size A
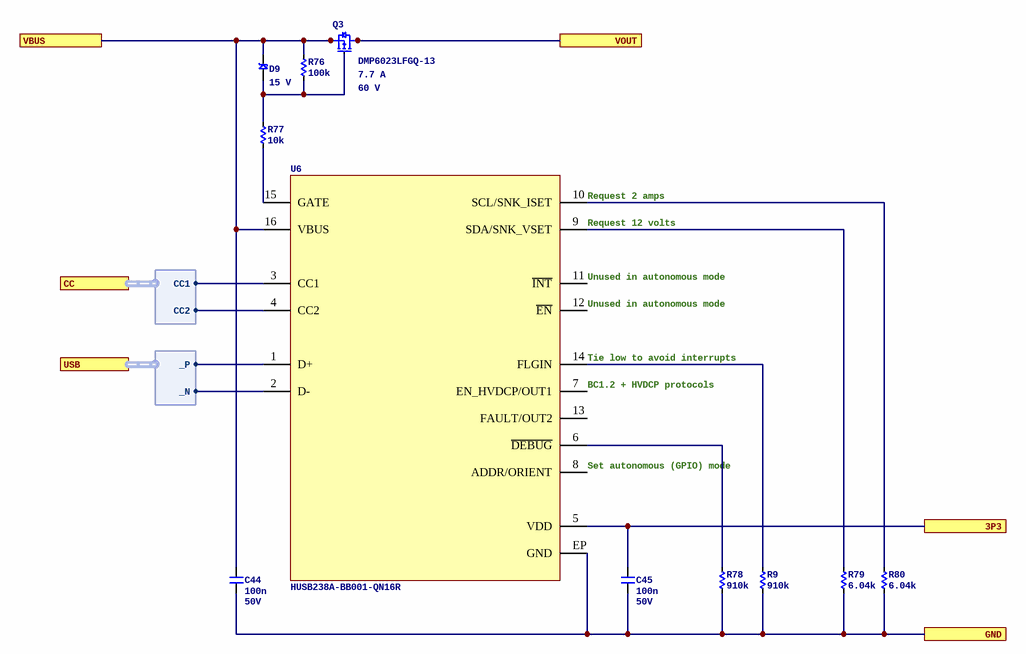
[diagram p3: usb_husb238a.SchDoc]

### Parts
C44  Capacitance: 100n  Voltage Rating: 50V  [C0402]  (hidden comment: CL05B104KB54PNC)
C45  Capacitance: 100n  Voltage Rating: 50V  [C0402]  (hidden comment: CL05B104KB54PNC)
D9  Voltage - Zener (Nom) (Vz): 15 V  [SOD323]  (hidden comment: MM3Z15VC)
Q3  DMP6023LFGQ-13  Current: 7.7 A  Voltage: 60 V  [DIODES_POWERDI3333-8]
R9  value 910k  [R0402]  (hidden comment: 0402WGF9103TCE)
R76  value 100k  [R0402]  (hidden comment: 0402WGF1003TCE)
R77  value 10k  [R0402]  (hidden comment: 0402WGF1002TCE)
R78  value 910k  [R0402]  (hidden comment: 0402WGF9103TCE)
R79  value 6.04k  [R0402]  (hidden comment: 0402WGF6041TCE)
R80  value 6.04k  [R0402]  (hidden comment: 0402WGF6041TCE)
U6  HUSB238A-BB001-QN16R  [QFN50P300X300X90-16N]

### Ports
3P3, CC (harness CC), GND, USB (harness DIFF), VBUS, VOUT

### Harnesses
CC: CC2, CC1
DIFF: _P, _N

### Nets
3P3: C45.1 U6.5(VDD) ; port 3P3
GND: C44.2 C45.2 R9.1 R78.1 R79.1 R80.1 U6.EP(GND) ; port GND
VBUS: Q3.5 Q3.6 Q3.7 Q3.8 ; port VOUT
CC_PWR.CC1: U6.3(CC1) ; port CC.CC1
CC_PWR.CC2: U6.4(CC2) ; port CC.CC2
USB_PWR._N: U6.2(D-) ; port USB._N
USB_PWR._P: U6.1(D+) ; port USB._P
NetC44_1: C44.1 D9.2 Q3.1 Q3.2 Q3.3 R76.2 U6.16(VBUS) ; port VBUS
NetD9_1: D9.1 Q3.4 R76.1 R77.2
NetR9_2: R9.2 U6.14(FLGIN)
NetR77_1: R77.1 U6.15(GATE)
NetR78_2: R78.2 U6.6(~{DEBUG})
NetR79_2: R79.2 U6.9(SDA/SNK_VSET)
NetR80_2: R80.2 U6.10(SCL/SNK_ISET)

Not connected (* = marked no-connect by the designer): U6 7(EN_HVDCP/OUT1) 8(ADDR/ORIENT) 11(~{INT}) 12(~{EN}) 13(FAULT/OUT2)

### Notes on the sheet
- (near U6) Request 2 amps
- (near U6) Request 12 volts
- (near U6) Unused in autonomous mode
- (near U6) BC1.2 + HVDCP protocols
- (near U6) Tie low to avoid interrupts
- (near U6) Set autonomous (GPIO) mode

### Library data of the parts
C44 C45 = CL05B104KB54PNC: as C4 on sheet mcu_stm32f427; ComponentLink1URL: https://wmsc.lcsc.com/wmsc/upload/file/pdf/v2/lcsc/2304140030_Samsung-Electro-Mechanics-CL05B104KB54PNC_C307331.pdf; ComponentLink1Description: Datasheet; Manufacturer Part Number: CL05B104KB54PNC; Package: 0402; Supplier 2: LCSC; Supplier Part Number 2: C307331
D9 = ZENER_MM3Z15VC: DIODE ZENER 15V 200MW SOD; Manufacturer: onsemi; Supplier 1: Digikey; Manufacturer Part Number: MM3Z15VC; ComponentLink1URL: https://www.onsemi.com/pdf/datasheet/mm3z9v1c-d.pdf; ComponentLink1Description: Datasheet; Supplier Part Number 1: MM3Z15VCCT-ND; Supplier 2: LCSC; Supplier Part Number 2: C891582
Q3 = PFET_60V_DMP6023LFGQ-13: Small Signal Field-Effect Transistor, 7.7A I(D), 60V, 1-Element, P-Channel, Silicon, Metal-oxide Semiconductor FET; Manufacturer: Diodes; Supplier 1: Digikey; Supplier Part Number 1: 31-DMP6023LFGQ-13CT-ND; Manufacturer Part Number: DMP6023LFGQ-13; ComponentLink1Description: Datasheet; ComponentLink1URL: https://www.diodes.com/assets/Datasheets/DMP6023LFGQ.pdf; Supplier 2: LCSC; Supplier Part Number 2: C672173
R9 R78 = 0402WGF9103TCE: Manufacturer: UNI-ROYAL(Uniroyal Elec); Tolerance: 1%; Temperature Coefficient: Â±100ppm/â„ƒ; Power Rating (mW): 62.5; ComponentLink1Description: Datasheet; ComponentLink1URL: https://wmsc.lcsc.com/wmsc/upload/file/pdf/v2/lcsc/2206010045_UNI-ROYAL-Uniroyal-Elec-0402WGF9103TCE_C25800.pdf; Manufacturer Part Number: 0402WGF9103TCE; Package: 0402; Supplier 2: LCSC; Supplier Part Number 2: C25800
R76 = 0402WGF1003TCE: Manufacturer: UNI-ROYAL(Uniroyal Elec); Tolerance: 1%; Temperature Coefficient: Â±100ppm/â„ƒ; Power Rating (mW): 62.5; ComponentLink1Description: Datasheet; ComponentLink1URL: https://wmsc.lcsc.com/wmsc/upload/file/pdf/v2/lcsc/2206010100_UNI-ROYAL-Uniroyal-Elec-0402WGF1003TCE_C25741.pdf; Manufacturer Part Number: 0402WGF1003TCE; Package: 0402; Supplier 2: LCSC; Supplier Part Number 2: C25741
R77 = 0402WGF1002TCE: as R30 on sheet mcu_stm32f427; ComponentLink1Description: Datasheet; ComponentLink1URL: https://wmsc.lcsc.com/wmsc/upload/file/pdf/v2/lcsc/2206010100_UNI-ROYAL-Uniroyal-Elec-0402WGF1002TCE_C25744.pdf; Manufacturer Part Number: 0402WGF1002TCE; Package: 0402; Supplier 2: LCSC; Supplier Part Number 2: C25744
R79 R80 = 0402WGF6041TCE: Manufacturer: UNI-ROYAL(Uniroyal Elec); Tolerance: 1%; Temperature Coefficient: Â±100ppm/â„ƒ; Power Rating (mW): 62.5; ComponentLink1Description: Datasheet; ComponentLink1URL: https://wmsc.lcsc.com/wmsc/upload/file/pdf/v2/lcsc/2206010045_UNI-ROYAL-Uniroyal-Elec-0402WGF6041TCE_C25913.pdf; Manufacturer Part Number: 0402WGF6041TCE; Package: 0402; Supplier 2: LCSC; Supplier Part Number 2: C25913
U6 = USB_PD_HUSB238A: USB PD EPR SINK CONTROLLER WITH I2C; Manufacturer: Hynetek; Supplier 1: LCSC; Supplier Part Number 1: C24833806; Manufacturer Part Number: HUSB238A-BB001-QN16R; ComponentLink1Description: Datasheet; ComponentLink1URL: https://www.lcsc.com/datasheet/lcsc_datasheet_2412301710_Hynetek-HUSB238A-BB001-QN16R_C24833806.pdf; ComponentLink2Description: Product page; ComponentLink2URL: https://en.hynetek.com/2643.html

## Sheet eth_lan8742a_phy.SchDoc
size A
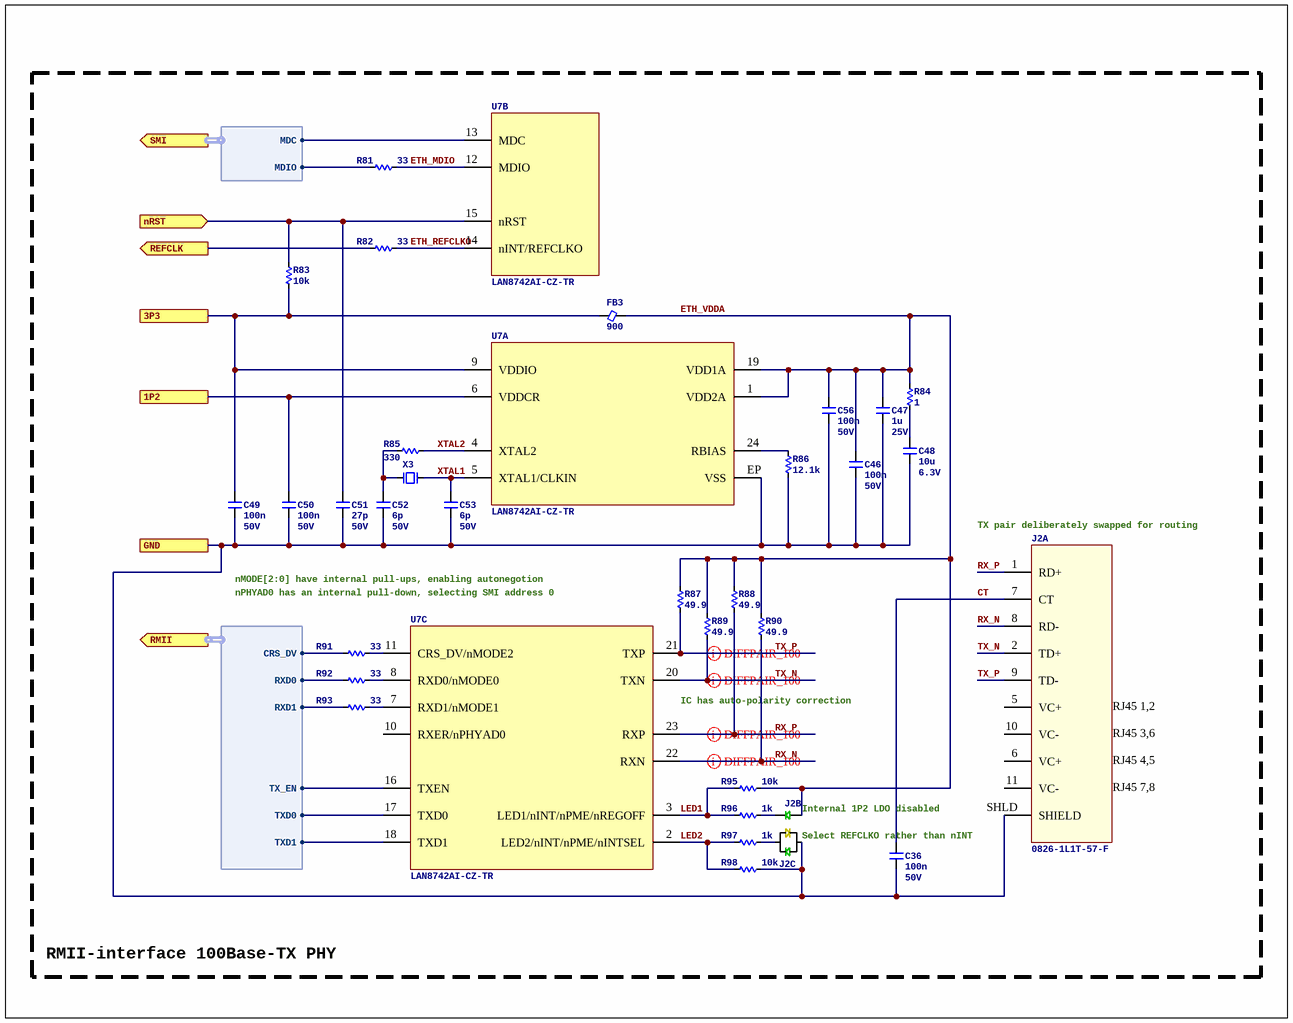
[diagram p4: eth_lan8742a_phy.SchDoc]

### Parts
C36  Capacitance: 100n  Voltage Rating: 50V  [C0402]  (hidden comment: CL05B104KB54PNC)
C46  Capacitance: 100n  Voltage Rating: 50V  [C0402]  (hidden comment: CL05B104KB54PNC)
C47  Capacitance: 1u  Voltage Rating: 25V  [C0603]  (hidden comment: CL10B105KA8NNNC)
C48  Capacitance: 10u  Voltage Rating: 6.3V  [C0805]  (hidden comment: CC0805KKX7R5BB106)
C49  Capacitance: 100n  Voltage Rating: 50V  [C0402]  (hidden comment: CL05B104KB54PNC)
C50  Capacitance: 100n  Voltage Rating: 50V  [C0402]  (hidden comment: CL05B104KB54PNC)
C51  Capacitance: 27p  Voltage Rating: 50V  [C0402]  (hidden comment: CC0402JRNPO9BN270)
C52  Capacitance: 6p  Voltage Rating: 50V  [C0402]  (hidden comment: CC0402CRNPO9BN6R0)
C53  Capacitance: 6p  Voltage Rating: 50V  [C0402]  (hidden comment: CC0402CRNPO9BN6R0)
C56  Capacitance: 100n  Voltage Rating: 50V  [C0402]  (hidden comment: CL05B104KB54PNC)
FB3  Current Rating (mA): 900  [FB0402]  (hidden comment: BLM15PX601SN1D)
J2  0826-1L1T-57-F  [BELFUSE_0826-1L1T-57-F]  (parts A,B,C of 3)
R81  value 33  [R0402]  (hidden comment: CRCW040233R0FKED)
R82  value 33  [R0402]  (hidden comment: CRCW040233R0FKED)
R83  value 10k  [R0402]  (hidden comment: 0402WGF1002TCE)
R84  value 1  [R0402]  (hidden comment: CRCW04021R00FKEDC)
R85  value 330  [R0402]  (hidden comment: 0402WGF3300TCE)
R86  value 12.1k  [R0402]  (hidden comment: RC0402FR-0712K1L)
R87  value 49.9  [R0402]  (hidden comment: 0402WGF499JTCE)
R88  value 49.9  [R0402]  (hidden comment: 0402WGF499JTCE)
R89  value 49.9  [R0402]  (hidden comment: 0402WGF499JTCE)
R90  value 49.9  [R0402]  (hidden comment: 0402WGF499JTCE)
R91  value 33  [R0402]  (hidden comment: CRCW040233R0FKED)
R92  value 33  [R0402]  (hidden comment: CRCW040233R0FKED)
R93  value 33  [R0402]  (hidden comment: CRCW040233R0FKED)
R95  value 10k  [R0402]  (hidden comment: 0402WGF1002TCE)
R96  value 1k  [R0402]  (hidden comment: 0402WGF1001TCE)
R97  value 1k  [R0402]  (hidden comment: 0402WGF1001TCE)
R98  value 10k  [R0402]  (hidden comment: 0402WGF1002TCE)
U7  LAN8742AI-CZ-TR  [24QFN4E]  (parts A,B,C of 3)
X3  XTAL_XRCGB25M000F3A00R0  [4_SMD_2.0X1.6MM]  (value not drawn)

### Ports
1P2, 3P3, GND, nRST (in), REFCLK (out), RMII (out, harness RMII), SMI (out, harness SMI)

### Harnesses
SMI: MDC, MDIO
RMII: CRS_DV, RXD0, RXD1, TX_EN, TXD0, TXD1

### Nets
1P2: C50.1 U7.6(VDDCR) ; port 1P2
3P3: C49.1 FB3.1 R83.1 U7.9(VDDIO) ; port 3P3
GND: C36.2 C46.2 C47.2 C48.2 C49.2 C50.2 C51.2 C52.2 C53.2 C56.2 J2.13 J2.SHLD(SHIELD) R86.2 R98.2 U7.EP(VSS) ; port GND
CT: C36.1 J2.7(CT)
ETH_MDIO: R81.1 U7.12(MDIO)
ETH_nRST: C51.1 R83.2 U7.15(nRST) ; port nRST
ETH_REFCLK: R82.2 ; port REFCLK
ETH_REFCLKO: R82.1 U7.14(nINT/REFCLKO)
ETH_VDDA: C46.1 C47.1 C56.1 FB3.2 J2.15 R84.2 R87.1 R88.1 R89.1 R90.1 R95.2 U7.1(VDD2A) U7.19(VDD1A)
LED1: R95.1 R96.2 U7.3(LED1/nINT/nPME/nREGOFF)
LED2: R97.2 R98.1 U7.2(LED2/nINT/nPME/nINTSEL)
RMII.CRS_DV: R91.2 ; port RMII.CRS_DV
RMII.RXD0: R92.2 ; port RMII.RXD0
RMII.RXD1: R93.2 ; port RMII.RXD1
RMII.TX_EN: U7.16(TXEN) ; port RMII.TX_EN
RMII.TXD0: U7.17(TXD0) ; port RMII.TXD0
RMII.TXD1: U7.18(TXD1) ; port RMII.TXD1
RX_N: J2.8(RD-) R90.2 U7.22(RXN)
RX_P: J2.1(RD+) R88.2 U7.23(RXP)
SMI.MDC: U7.13(MDC) ; port SMI.MDC
SMI.MDIO: R81.2 ; port SMI.MDIO
TX_N: J2.2(TD+) R89.2 U7.20(TXN)
TX_P: J2.9(TD-) R87.2 U7.21(TXP)
XTAL1: C53.1 U7.5(XTAL1/CLKIN) X3.1
XTAL2: R85.2 U7.4(XTAL2)
NetC48_1: C48.1 R84.1
NetC52_1: C52.1 R85.1 X3.3
NetJ2_12: J2.12 R97.1
NetJ2_14: J2.14 R96.1
NetR86_1: R86.1 U7.24(RBIAS)
NetR91_1: R91.1 U7.11(CRS_DV/nMODE2)
NetR92_1: R92.1 U7.8(RXD0/nMODE0)
NetR93_1: R93.1 U7.7(RXD1/nMODE1)

Not connected (* = marked no-connect by the designer): J2 5(VC+) 6(VC+) 10(VC-) 11(VC-); U7 10(RXER/nPHYAD0)

### Layout directives
differential pair; differential pair class DE_100: RX_N, RX_P, TX_N, TX_P

### Notes on the sheet
- (near J2) TX pair deliberately swapped for routing
- nMODE[2:0] have internal pull-ups, enabling autonegotion
- nPHYAD0 has an internal pull-down, selecting SMI address 0
- (near U7) IC has auto-polarity correction
- (near J2) Internal 1P2 LDO disabled
- Select REFCLKO rather than nINT
- RMII-interface 100Base-TX PHY
- (in symbol CONN_BELFUSE_ETHERNET_0826-1L1T-57-F, part A) RJ45 1,2; RJ45 3,6; RJ45 4,5; RJ45 7,8
- (in symbol 0826-1L1T-57-F, part A) RJ45 1,2; RJ45 3,6; RJ45 4,5; RJ45 7,8

### Library data of the parts
C36 C46 C49 C50 C56 = CL05B104KB54PNC: as C4 on sheet mcu_stm32f427; ComponentLink1URL: https://wmsc.lcsc.com/wmsc/upload/file/pdf/v2/lcsc/2304140030_Samsung-Electro-Mechanics-CL05B104KB54PNC_C307331.pdf; ComponentLink1Description: Datasheet; Manufacturer Part Number: CL05B104KB54PNC; Package: 0402; Supplier 2: LCSC; Supplier Part Number 2: C307331
C47 = CL10B105KA8NNNC: as C12 on sheet mcu_stm32f427; ComponentLink1URL: https://wmsc.lcsc.com/wmsc/upload/file/pdf/v2/lcsc/2304140030_Samsung-Electro-Mechanics-CL10B105KA8NNNC_C29936.pdf; ComponentLink1Description: Datasheet; Manufacturer Part Number: CL10B105KA8NNNC; Package: 0603; Supplier 2: LCSC; Supplier Part Number 2: C29936
C48 = CC0805KKX7R5BB106: Manufacturer: YAGEO; Dielectric: X7R; ComponentLink1URL: https://wmsc.lcsc.com/wmsc/upload/file/pdf/v2/lcsc/2409272300_YAGEO-CC0805KKX7R5BB106_C527225.pdf; ComponentLink1Description: Datasheet; Manufacturer Part Number: CC0805KKX7R5BB106; Package: 0805; Supplier 2: LCSC; Supplier Part Number 2: C527225
C51 = CC0402JRNPO9BN270: Manufacturer: YAGEO; Dielectric: NP0; ComponentLink1URL: https://wmsc.lcsc.com/wmsc/upload/file/pdf/v2/lcsc/2304140030_YAGEO-CC0402JRNPO9BN270_C107002.pdf; ComponentLink1Description: Datasheet; Manufacturer Part Number: CC0402JRNPO9BN270; Package: 0402; Supplier 2: LCSC; Supplier Part Number 2: C107002
C52 C53 = CC0402CRNPO9BN6R0: Manufacturer: YAGEO; Dielectric: NP0; ComponentLink1URL: https://wmsc.lcsc.com/wmsc/upload/file/pdf/v2/lcsc/2007101237_YAGEO-CC0402CRNPO9BN6R0_C700515.pdf; ComponentLink1Description: Datasheet; Manufacturer Part Number: CC0402CRNPO9BN6R0; Package: 0402; Supplier 2: LCSC; Supplier Part Number 2: C700515
FB3 = BLM15PX601SN1D: as FB1 on sheet mcu_stm32f427; ComponentLink1URL: https://wmsc.lcsc.com/wmsc/upload/file/pdf/v2/lcsc/2304140030_Murata-Electronics-BLM15PX601SN1D_C160977.pdf; ComponentLink1Description: Datasheet; Manufacturer Part Number: BLM15PX601SN1D; Supplier 2: LCSC; Supplier Part Number 2: C160977; Package: 0402
J2 = CONN_BELFUSE_ETHERNET_0826-1L1T-57-F: CONN MAGJACK 1PORT 100 BASE-T; Manufacturer: Bel Fuse Inc; Supplier 1: Digikey; Supplier Part Number 1: 507-1431-ND; ComponentLink1URL: https://www.belfuse.com/resources/drawings/magneticsolutions/dr-mag-0826-1l1t-57-f.pdf; ComponentLink1Description: Datasheet; Manufacturer Part Number: 0826-1L1T-57-F; Supplier 2: LCSC; Supplier Part Number 2: C3179913
R81 R82 R91-R93 = CRCW040233R0FKED: as R3 on sheet mcu_stm32f427; ComponentLink1Description: Datasheet; ComponentLink1URL: https://wmsc.lcsc.com/wmsc/upload/file/pdf/v2/lcsc/2304140030_Vishay-Intertech-CRCW040233R0FKED_C242490.pdf; Manufacturer Part Number: CRCW040233R0FKED; Package: 0402; Supplier 2: LCSC; Supplier Part Number 2: C242490
R83 R95 R98 = 0402WGF1002TCE: as R30 on sheet mcu_stm32f427; ComponentLink1Description: Datasheet; ComponentLink1URL: https://wmsc.lcsc.com/wmsc/upload/file/pdf/v2/lcsc/2206010100_UNI-ROYAL-Uniroyal-Elec-0402WGF1002TCE_C25744.pdf; Manufacturer Part Number: 0402WGF1002TCE; Package: 0402; Supplier 2: LCSC; Supplier Part Number 2: C25744
R84 = CRCW04021R00FKEDC: as R11 on sheet mcu_stm32f427; ComponentLink1Description: Datasheet; ComponentLink1URL: https://datasheet.lcsc.com/lcsc/2304140030_Vishay-Intertech-CRCW04021R00FKEDC_C2077765.pdf; Manufacturer Part Number: CRCW04021R00FKEDC; Package: 0402; Supplier 2: LCSC; Supplier Part Number 2: C2077765
R85 = 0402WGF3300TCE: as R42 on sheet mcu_stm32f427; ComponentLink1Description: Datasheet; ComponentLink1URL: https://wmsc.lcsc.com/wmsc/upload/file/pdf/v2/lcsc/2205311900_UNI-ROYAL-Uniroyal-Elec-0402WGF3300TCE_C25104.pdf; Manufacturer Part Number: 0402WGF3300TCE; Package: 0402; Supplier 2: LCSC; Supplier Part Number 2: C25104
R86 = RC0402FR-0712K1L: Manufacturer: YAGEO; Tolerance: 1%; Temperature Coefficient: Â±100ppm/â„ƒ; Power Rating (mW): 62.5; ComponentLink1Description: Datasheet; ComponentLink1URL: https://wmsc.lcsc.com/wmsc/upload/file/pdf/v2/lcsc/2304140030_YAGEO-RC0402FR-0712K1L_C132157.pdf; Manufacturer Part Number: RC0402FR-0712K1L; Package: 0402; Supplier 2: LCSC; Supplier Part Number 2: C132157
R87-R90 = 0402WGF499JTCE: Manufacturer: UNI-ROYAL(Uniroyal Elec); Tolerance: 1%; Temperature Coefficient: Â±100ppm/â„ƒ; Power Rating (mW): 62.5; ComponentLink1Description: Datasheet; ComponentLink1URL: https://wmsc.lcsc.com/wmsc/upload/file/pdf/v2/lcsc/2205311900_UNI-ROYAL-Uniroyal-Elec-0402WGF499JTCE_C25120.pdf; Manufacturer Part Number: 0402WGF499JTCE; Package: 0402; Supplier 2: LCSC; Supplier Part Number 2: C25120
R96 R97 = 0402WGF1001TCE: as R1 on sheet mcu_stm32f427; ComponentLink1Description: Datasheet; ComponentLink1URL: https://wmsc.lcsc.com/wmsc/upload/file/pdf/v2/lcsc/2206010216_UNI-ROYAL-Uniroyal-Elec-0402WGF1001TCE_C11702.pdf; Manufacturer Part Number: 0402WGF1001TCE; Package: 0402; Supplier 2: LCSC; Supplier Part Number 2: C11702
U7 = ETH_PHY_LAN8742AI: Ethernet Transceiver, PQCC24; Manufacturer: Microchip; Supplier 1: Digikey; Supplier Part Number 1: LAN8742AI-CZ-CT-ND; Manufacturer Part Number: LAN8742AI-CZ-TR; ComponentLink1URL: https://ww1.microchip.com/downloads/aemDocuments/documents/OTH/ProductDocuments/DataSheets/8742a.pdf; ComponentLink1Description: Datasheet; Supplier 2: LCSC; Supplier Part Number 2: C153279
X3 = XTAL_XRCGB25M000F3A00R0: as X1 on sheet mcu_stm32f427; Supplier 1: Digikey; Supplier Part Number 1: 490-12146-2-ND; Manufacturer Part Number: XRCGB25M000F3A00R0; ComponentLink1Description: Datasheet; ComponentLink1URL: https://www.murata.com/products/productdata/8801076543518/SPEC-XRCGB25M000F3A00R0.pdf; Supplier 2: LCSC; Supplier Part Number 2: C467842

## Sheet 4ch_flyback.SchDoc
size A
Used 4 times, as channels 4ch_flyback0, 4ch_flyback1, 4ch_flyback2, 4ch_flyback3. Parts and nets are listed once, with the designators drawn on the sheet.
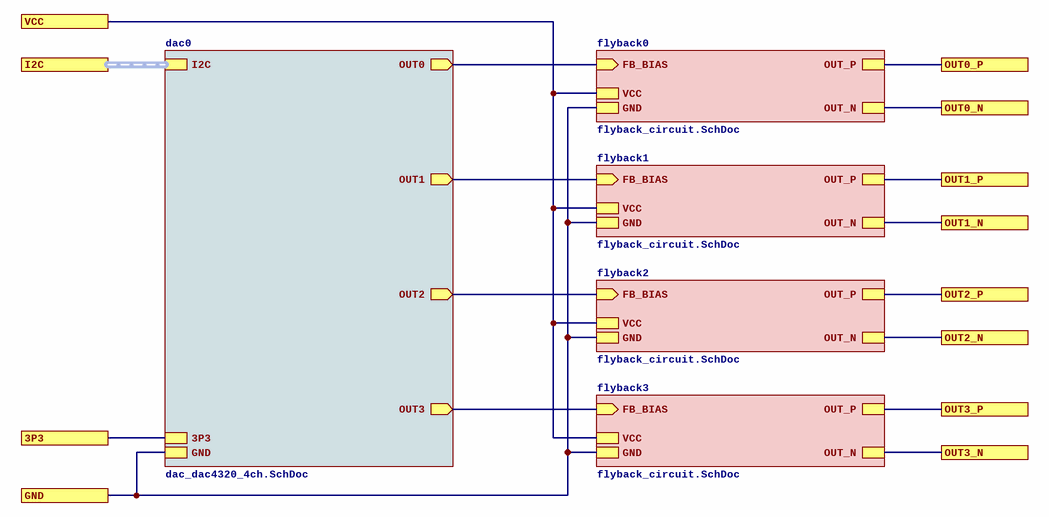
[diagram p5: 4ch_flyback.SchDoc]

### Sub-sheets
dac0 = dac_dac4320_4ch.SchDoc: I2C (harness I2C), OUT1 (out), OUT2 (out), OUT3 (out), OUT0 (out), GND, 3P3
flyback0 = flyback_circuit.SchDoc: FB_BIAS (in), GND, VCC, OUT_P, OUT_N
flyback1 = flyback_circuit.SchDoc: FB_BIAS (in), GND, VCC, OUT_P, OUT_N
flyback2 = flyback_circuit.SchDoc: FB_BIAS (in), GND, VCC, OUT_P, OUT_N
flyback3 = flyback_circuit.SchDoc: FB_BIAS (in), GND, VCC, OUT_P, OUT_N

### Ports
3P3, GND, I2C (harness I2C), OUT0_N, OUT0_P, OUT1_N, OUT1_P, OUT2_N, OUT2_P, OUT3_N, OUT3_P, VCC

### Nets
3P3: port 3P3, sheet dac0/3P3
GND: port GND, sheet flyback0/GND, sheet flyback1/GND, sheet flyback2/GND, sheet flyback3/GND, sheet dac0/GND
OUT0_N: port OUT0_N, sheet flyback0/OUT_N
OUT0_P: port OUT0_P, sheet flyback0/OUT_P
OUT1_N: port OUT1_N, sheet flyback1/OUT_N
OUT1_P: port OUT1_P, sheet flyback1/OUT_P
OUT2_N: port OUT2_N, sheet flyback2/OUT_N
OUT2_P: port OUT2_P, sheet flyback2/OUT_P
OUT3_N: port OUT3_N, sheet flyback3/OUT_N
OUT3_P: port OUT3_P, sheet flyback3/OUT_P
VCC: port VCC, sheet flyback0/VCC, sheet flyback1/VCC, sheet flyback2/VCC, sheet flyback3/VCC
(unnamed): sheet flyback0/FB_BIAS, sheet dac0/OUT0
(unnamed): sheet flyback1/FB_BIAS, sheet dac0/OUT1
(unnamed): sheet flyback2/FB_BIAS, sheet dac0/OUT2
(unnamed): sheet flyback3/FB_BIAS, sheet dac0/OUT3

### Channels
4ch_flyback0: ports 3P3=3P3 GND=GND OUT0_N=C0_N OUT0_P=C0_P OUT1_N=C1_N OUT1_P=C1_P OUT2_N=C2_N OUT2_P=C2_P OUT3_N=C3_N OUT3_P=C3_P VCC=VBUS
4ch_flyback1: ports 3P3=3P3 GND=GND OUT0_N=C4_N OUT0_P=C4_P OUT1_N=C5_N OUT1_P=C5_P OUT2_N=C6_N OUT2_P=C6_P OUT3_N=C7_N OUT3_P=C7_P VCC=VBUS
4ch_flyback2: ports 3P3=3P3 GND=GND OUT0_N=C8_N OUT0_P=C8_P OUT1_N=C9_N OUT1_P=C9_P OUT2_N=C10_N OUT2_P=C10_P OUT3_N=C11_N OUT3_P=C11_P VCC=VBUS
4ch_flyback3: ports 3P3=3P3 GND=GND OUT0_N=C12_N OUT0_P=C12_P OUT1_N=C13_N OUT1_P=C13_P OUT2_N=C14_N OUT2_P=C14_P OUT3_N=C15_N OUT3_P=C15_P VCC=VBUS

### Buses and harness runs
harness port I2C = sheet dac0/I2C